# EAGLE design schaltplan_v2 (EAGLE 6.4)
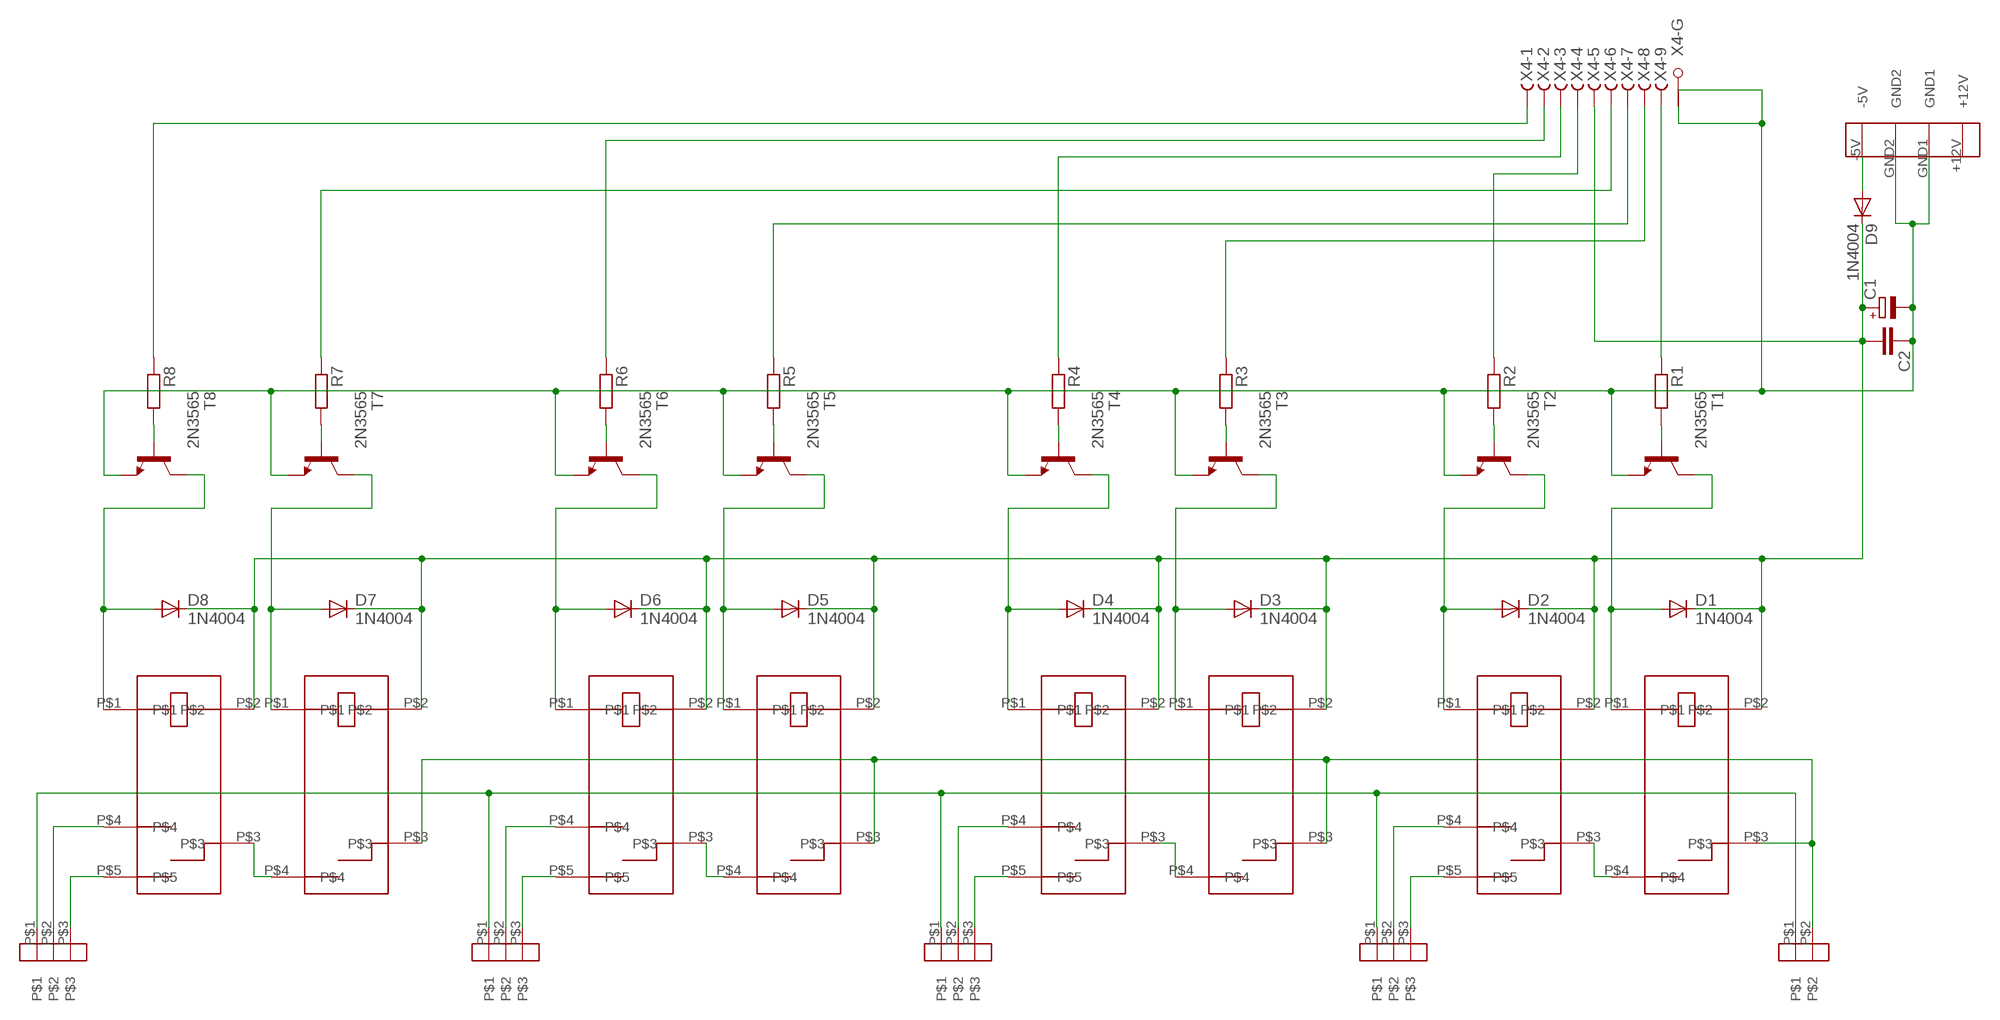
[diagram p0: schematic, sheet 1]

## Parts
C1  CPOL-EUE3.5-8  [E3,5-8]
C2  C-EU025-030X050  [C025-030X050]
D1  1N4004  [DO41-10]
D2  1N4004  [DO41-10]
D3  1N4004  [DO41-10]
D4  1N4004  [DO41-10]
D5  1N4004  [DO41-10]
D6  1N4004  [DO41-10]
D7  1N4004  [DO41-10]
D8  1N4004  [DO41-10]
D9  1N4004  [DO41-10]
R1  R-EU_0207/7  [0207/7]
R2  R-EU_0207/7  [0207/7]
R3  R-EU_0207/7  [0207/7]
R4  R-EU_0207/7  [0207/7]
R5  R-EU_0207/7  [0207/7]
R6  R-EU_0207/7  [0207/7]
R7  R-EU_0207/7  [0207/7]
R8  R-EU_0207/7  [0207/7]
T1  2N3565  [TO92]
T2  2N3565  [TO92]
T3  2N3565  [TO92]
T4  2N3565  [TO92]
T5  2N3565  [TO92]
T6  2N3565  [TO92]
T7  2N3565  [TO92]
T8  2N3565  [TO92]
U$1  JS_05_MN_KT  [JS_05_MN_KT]
U$2  JS_05_N_K  [JS_05_N_K]
U$3  JS_05_MN_KT  [JS_05_MN_KT]
U$4  JS_05_N_K  [JS_05_N_K]
U$5  JS_05_MN_KT  [JS_05_MN_KT]
U$6  JS_05_N_K  [JS_05_N_K]
U$7  JS_05_MN_KT  [JS_05_MN_KT]
U$8  JS_05_N_K  [JS_05_N_K]
U$9  WAGO_734_262  [WAGO_734_262]
U$10  WAGO_734_263  [WAGO_734_263]
U$11  WAGO_734_263  [WAGO_734_263]
U$12  WAGO_734_263  [WAGO_734_263]
U$13  WAGO_734_263  [WAGO_734_263]
U$14  PSW_5  [PSW_5]
X4  F09HPS  [F09HP]

## Nets
GND: C1.- C2.1 T1.3(E) T2.3(E) T3.3(E) T4.3(E) T5.3(E) T6.3(E) T7.3(E) T8.3(E) U$14.GND1 U$14.GND2 X4.G1(-G:G1) X4.G2(-G:G2)
GND2: U$9.P$1 U$10.P$1 U$11.P$1 U$12.P$1 U$13.P$1
N$2: U$2.P$5 U$10.P$3
N$3: U$2.P$4 U$10.P$2
N$4: U$1.P$4 U$2.P$3
N$5: U$1.P$3 U$3.P$3 U$5.P$3 U$7.P$3 U$9.P$2
N$6: D1.A T1.1(C) U$1.P$1
N$7: D9.A U$14.-5V
N$8: R1.2 T1.2(B)
N$10: D2.A T2.1(C) U$2.P$1
N$11: R5.1 X4.7(-7:F)
N$12: D3.A T3.1(C) U$3.P$1
N$13: R6.2 T6.2(B)
N$14: R6.1 X4.2(-2:F)
N$15: R8.1 X4.1(-1:F)
N$16: U$4.P$5 U$11.P$3
N$17: U$4.P$4 U$11.P$2
N$18: U$3.P$4 U$4.P$3
N$19: D4.A T4.1(C) U$4.P$1
N$21: R7.1 X4.6(-6:F)
N$22: R3.2 T3.2(B)
N$23: R4.1 X4.3(-3:F)
N$24: D5.A T5.1(C) U$5.P$1
N$26: R2.1 X4.4(-4:F)
N$27: R2.2 T2.2(B)
N$28: R4.2 T4.2(B)
N$30: U$6.P$5 U$12.P$3
N$31: U$6.P$4 U$12.P$2
N$32: U$5.P$4 U$6.P$3
N$33: D6.A T6.1(C) U$6.P$1
N$34: D7.A T7.1(C) U$7.P$1
N$35: D8.A T8.1(C) U$8.P$1
N$36: R5.2 T5.2(B)
N$37: R3.1 X4.8(-8:F)
N$38: R1.1 X4.9(-9:F)
N$40: R8.2 T8.2(B)
N$42: U$8.P$5 U$13.P$3
N$43: U$8.P$4 U$13.P$2
N$44: U$7.P$4 U$8.P$3
N$48: R7.2 T7.2(B)
V+: C1.+ C2.2 D1.C D2.C D3.C D4.C D5.C D6.C D7.C D8.C D9.C U$1.P$2 U$2.P$2 U$3.P$2 U$4.P$2 U$5.P$2 U$6.P$2 U$7.P$2 U$8.P$2 X4.5(-5:F)
Unconnected: U$14.+12V

## Library data of the parts
C1 = rcl:CPOL-EU: POLARIZED CAPACITOR, European symbol
C2 = rcl:C-EU: CAPACITOR, European symbol
D1-D9 = diode:1N4004: DIODE general purpose rectifier, 1 A
R1-R8 = rcl:R-EU_: RESISTOR, European symbol
T1-T8 = transistor:2N3565: NPN TRANSISTOR
U$1 U$3 U$5 U$7 = n39:JS_05_MN_KT
U$2 U$4 U$6 U$8 = n39:JS_05_N_K: Schaltrelais JK 05 N K http://www.reichelt.de/Print-Steckrelais/JS-05-N-K/3//index.html?ACTION=3&GROUPID=3293&ARTICLE=79414&SHOW=1&START=0&OFFSET=16&
U$9 = n39:WAGO_734_262: WAGO 743-262 Print-Stiftleiste, Mini, RM 3,81, gewinkelt, 2-polig http://www.reichelt.de/WAGO-Stecksysteme/WAGO-734-262/3/index.html?;ACTION=3;LA=446;ARTICLE=45978;GROUPID=5690;artnr=WAGO+734-262;SID=11UOMKs38AAAIAABbvFEc5b11be4da1ac9cc045b827e422a49e7b
U$10-U$13 = n39:WAGO_734_263: WAGO 734-263 Print-Stiftleiste, Mini, RM 3,81, gewinkelt, 3-polig http://www.reichelt.de/WAGO-Stecksysteme/WAGO-734-263/3/index.html?;ACTION=3;LA=446;ARTICLE=45980;GROUPID=5690;artnr=WAGO+734-263;SID=11UOMKs38AAAIAABbvFEc5b11be4da1ac9cc045b827e422a49e7b
U$14 = n39:PSW_5: PSW 5 Stromversorgungsstecker f. 5 1/4 Zoll, Print, gew. http://www.reichelt.de/Floppy-Powerstecker/PSW-5/3/index.html?;ACTION=3;LA=446;ARTICLE=14915;GROUPID=3257;artnr=PSW+5;SID=11UOMKs38AAAIAABbvFEc5b11be4da1ac9cc045b827e422a49e7b
X4 = con-subd:F09HPS: SUB-D; OC_FARNELL: unknown; OC_NEWARK: unknown

## Board
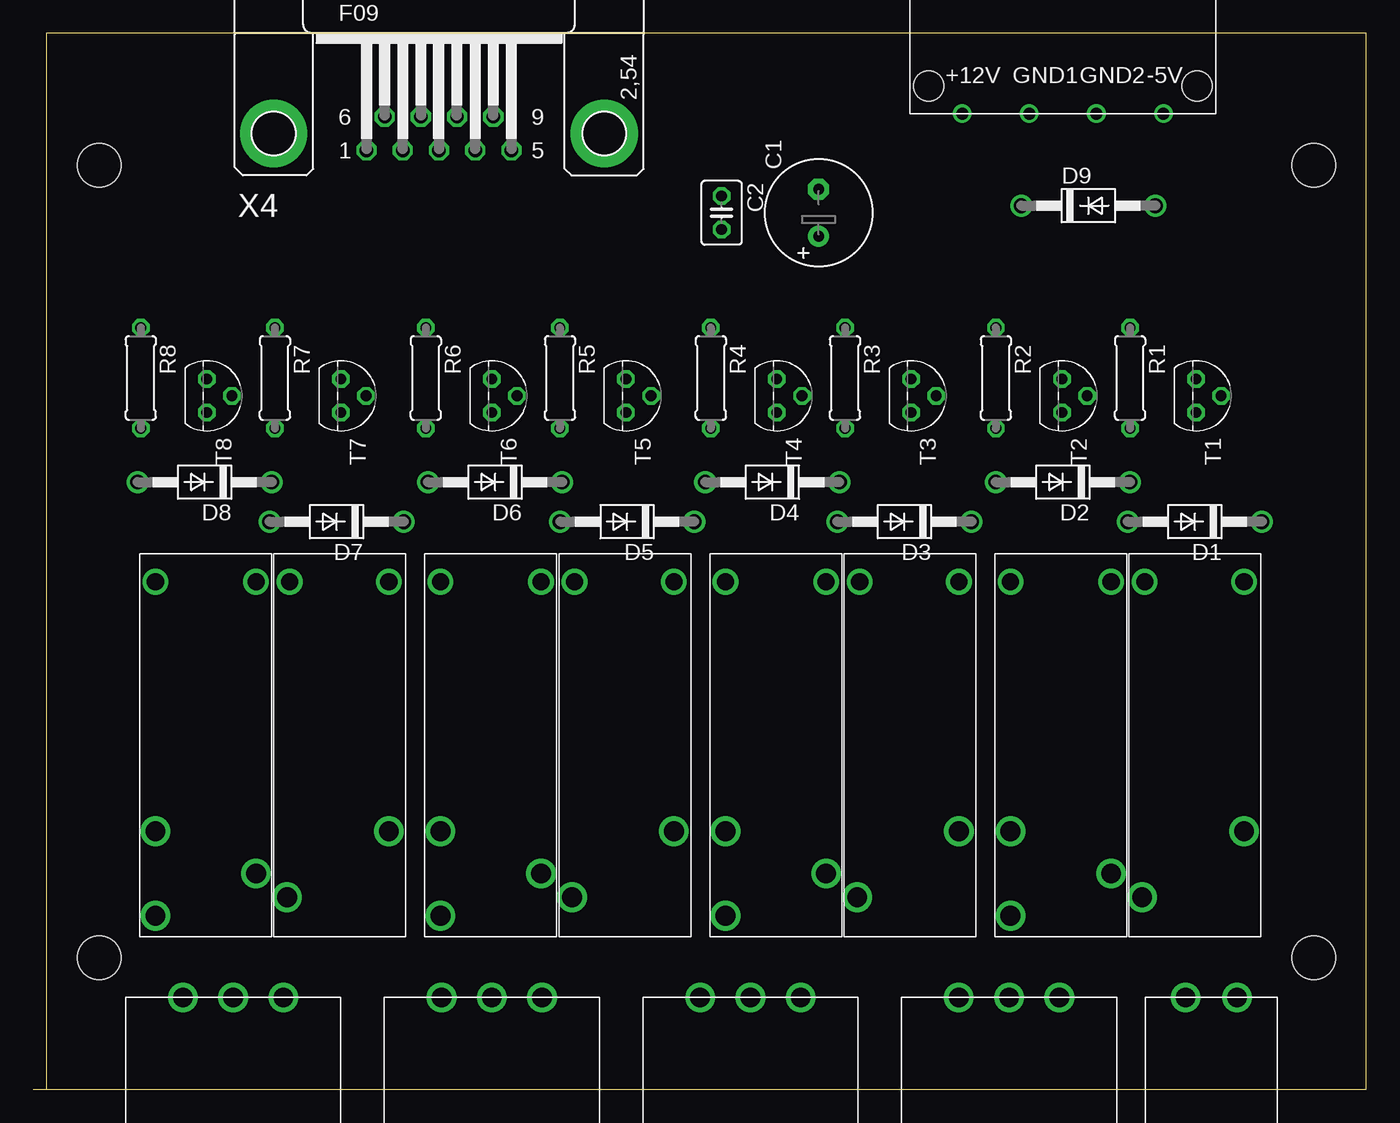
[diagram p1: board, top side]
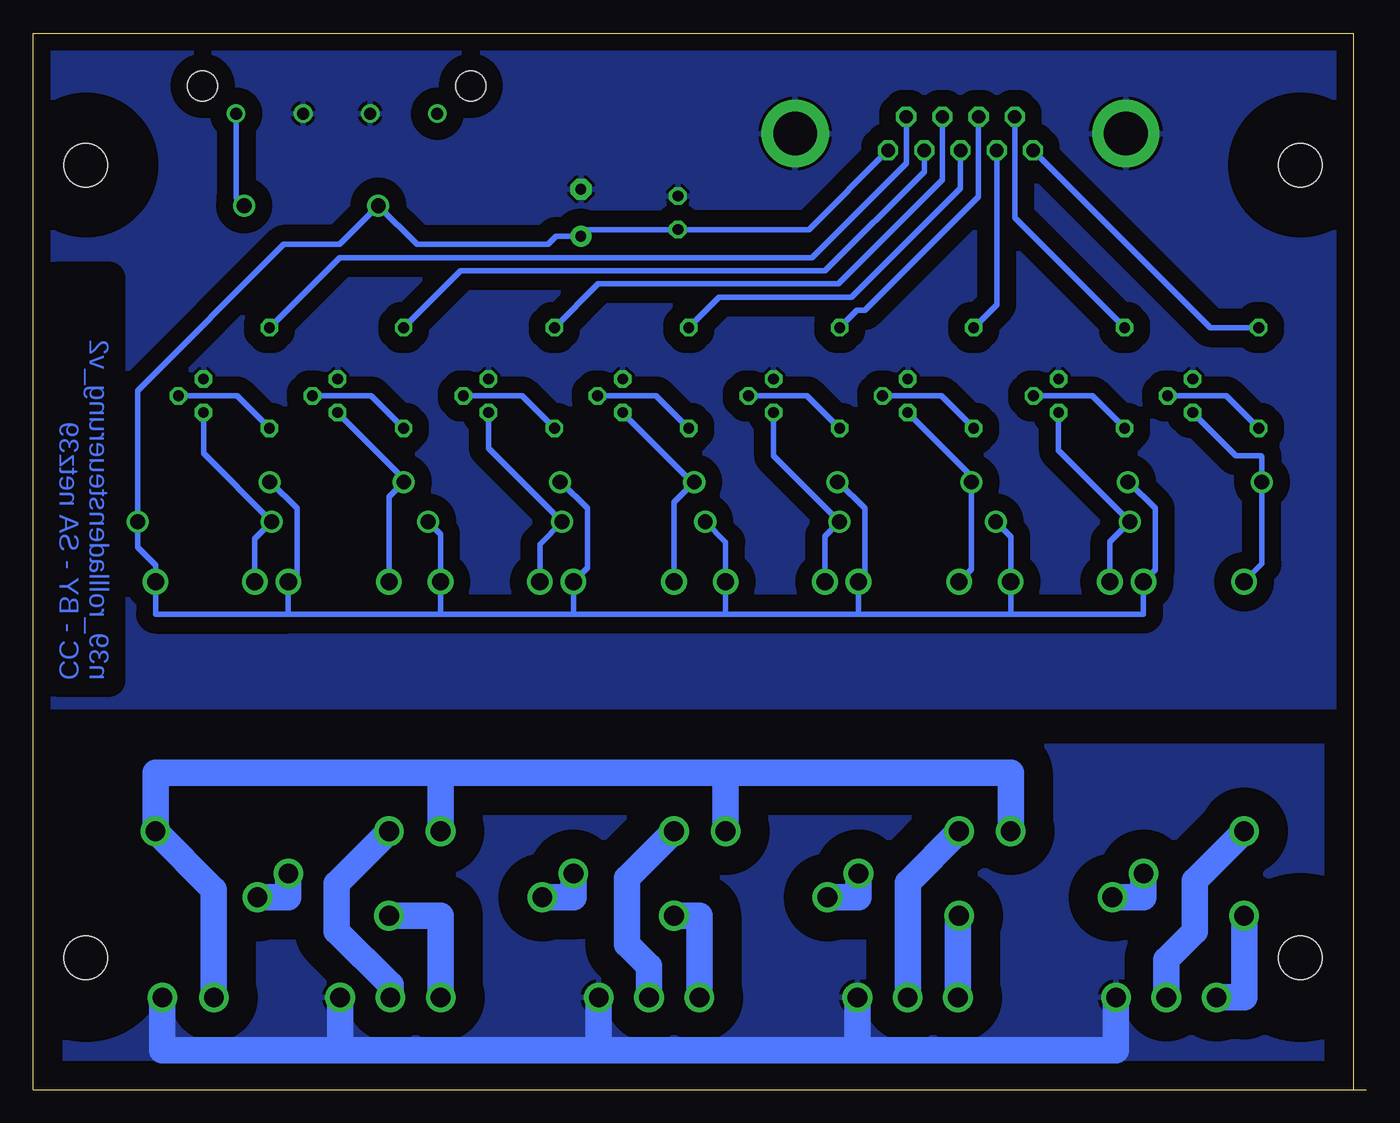
[diagram p2: board, bottom side, seen from below]

Size 101 x 80.01 mm. Coordinates in mm from the lower left corner, seen from the top.
Outline: 101,0.01 101,80.01 1,80.01 1,0.01
Outline: 101,0 0,0
Copper layers (1*16): Top 0.035mm / dielectric 1.5mm / Bottom 0.035mm
Design rules "designrules": minimum track width 12mil, minimum drill 32mil, track to track 12mil, track to pad 12mil, pad to pad 12mil, via to via 12mil, smd to smd 12mil, copper to edge 25mil, drill to drill 12mil, minimum pad ring 10mil, minimum via ring 8mil, stop-mask expansion 4mil, vias tented up to drill 0mil, thermal gap 10mil
Holes 3.3 mm at 5,70.01 97,70.01 97,10.01 5,10.01
bRestrict: area 1,6 to 9,14; area 1,66 to 9,74; area 93,66 to 101,74; area 93,6 to 101,14

### Footprints (pad centres in the part's own frame; a part is rotated, then mirrored left to right if it is on the bottom)
E3,5-8 = drill 0.813 pad 1.6: + -1.778,0 | drill 0.813 pad 1.6 octagon: - 1.778,0
C025-030X050 = drill 0.813 octagon: 1 -1.27,0; 2 1.27,0
DO41-10 = drill 1.118: A 5.08,0; C -5.08,0
0207/7 = drill 0.813 octagon: 1 -3.81,0; 2 3.81,0
TO92 = drill 0.813 octagon: 1 1.27,0; 2 0,1.905; 3 -1.27,0
JS_05_MN_KT = drill 1.3: P$1 2.1,1.19; P$2 2.1,8.71 | drill 1.5: P$3 21,8.71; P$4 26,1
JS_05_N_K = drill 1.3: P$1 2.1,1.19; P$2 2.1,8.81 | drill 1.5: P$3 24.2,8.81; P$4 21,1.19; P$5 27.4,1.19
WAGO_734_262 = drill 1.5: P$1 -1.95,-5.25; P$2 1.95,-5.25
WAGO_734_263 = drill 1.5: P$1 -3.81,-5.25; P$2 0,-5.25; P$3 3.81,-5.25
PSW_5 = drill 0.9: +12V -7.62,-6.1; -5V 7.62,-6.1; GND1 -2.54,-6.1; GND2 2.54,-6.1 | hole 2.3: -10.16,-4; 10.16,-4
F09HP = drill 1.016 octagon: 1 -5.486,-1.27; 2 -2.743,-1.27; 3 0,-1.27; 4 2.743,-1.27; 5 5.486,-1.27; 6 -4.115,1.27; 7 -1.372,1.27; 8 1.372,1.27; 9 4.115,1.27 | drill 3.302 pad 5.08: G1 -12.522,0; G2 12.522,0

### Placement (x,y rotation side)
C1  59.5,66.4 90 top
C2  52.15,66.4 270 top
D1  88,43.01 180 top
D2  78,46.01 180 top
D3  66,43.01 180 top
D4  56,46.01 180 top
D5  45,43.01 180 top
D6  35,46.01 180 top
D7  23,43.01 180 top
D8  13,46.01 180 top
D9  79.93,66.94 0 top
R1  83.09,53.89 270 top
R2  72.93,53.89 270 top
R3  61.5,53.89 270 top
R4  51.34,53.89 270 top
R5  39.91,53.89 270 top
R6  29.75,53.89 270 top
R7  18.32,53.89 270 top
R8  8.16,53.89 270 top
T1  88.09,52.54 270 top
T2  77.93,52.54 270 top
T3  66.5,52.54 270 top
T4  56.34,52.54 270 top
T5  44.91,52.54 270 top
T6  34.75,52.54 270 top
T7  23.32,52.54 270 top
T8  13.16,52.54 270 top
U$1  83.01,40.57 270 top
U$2  72.85,40.57 270 top
U$3  61.42,40.57 270 top
U$4  51.26,40.57 270 top
U$5  39.83,40.57 270 top
U$6  29.67,40.57 270 top
U$7  18.24,40.57 270 top
U$8  8.08,40.57 270 top
U$9  89.25,1.74 180 top
U$10  73.93,1.74 180 top
U$11  54.34,1.74 180 top
U$12  34.75,1.74 180 top
U$13  15.16,1.74 180 top
U$14  78,80.01 0 top
X4  30.75,72.4 0 top

### Tracks (layer width: path | path; a pad name or v marks a point on that pad's centre or on a via)
GND
  pour Bottom (isolate 1.27): 2,79.01 100,79.01 100,29.01 2,29.01
GND2
  Bottom 2: U$9.P$1 91.2,3.01 77.74,3.01 | U$10.P$1 77.74,3.01 | 77.74,3.01 58.15,3.01 | U$11.P$1 58.15,3.01 | 58.15,3.01 38.56,3.01 | U$12.P$1 38.56,3.01 | 38.56,3.01 18.97,3.01 U$13.P$1
  pour Bottom (isolate 2.184): 2,1.01 2,26.01 100,26.01 100,1.01
N$2
  Bottom 2: U$2.P$5 70.12,13.17 U$10.P$3
N$3
  Bottom 2: U$2.P$4 78,15.61 78,12.01 73.93,7.94 U$10.P$2
N$4
  Bottom 2: U$1.P$4 81.66,14.57 U$2.P$3
N$5
  Bottom 2: U$9.P$2 87.3,15.15 U$1.P$3 91.72,24.01 70.13,24.01 | U$3.P$3 70.13,24.01 | 70.13,24.01 48.54,24.01 | U$5.P$3 48.54,24.01 | 48.54,24.01 26.95,24.01 U$7.P$3
N$6
  Bottom 0.406: U$1.P$1 84.2,41.73 D1.A 88.09,48.18 T1.1
N$7
  Bottom 0.406: U$14.-5V 85.62,67.55 D9.A
N$8
  Bottom 0.406: T1.2 85.55,52.54 R1.2
N$10
  Bottom 0.406: U$2.P$1 74.04,44.89 D2.A 72.92,46.26 T2.1
N$11
  Bottom 0.406: X4.7 29.38,67.63 38,59.01 38.6,59.01 R5.1
N$12
  Bottom 0.406: T3.1 66.5,48.59 D3.A 62.61,41.32 U$3.P$1
N$13
  Bottom 0.406: T6.2 32.21,52.54 R6.2
N$14
  Bottom 0.406: R6.1 28.01,59.44 X4.2
N$15
  Bottom 0.406: X4.1 11.83,57.7 R8.1
N$16
  Bottom 2: U$4.P$5 50.53,13.17 U$11.P$3
N$17
  Bottom 2: U$4.P$4 56,16.02 56,11.01 54.34,9.35 U$11.P$2
N$18
  Bottom 2: U$3.P$4 60.07,14.57 U$4.P$3
N$19
  Bottom 0.406: U$4.P$1 52.45,44.48 D4.A 51.08,46.01 T4.1
N$21
  Bottom 0.406: R7.1 26.64,66.02 X4.6
N$22
  Bottom 0.406: T3.2 63.96,52.54 R3.2
N$23
  Bottom 0.406: X4.3 30.75,68.26 39,60.01 49.03,60.01 R4.1
N$24
  Bottom 0.406: T5.1 44.91,48 D5.A 41.02,41.91 U$5.P$1
N$26
  Bottom 0.406: X4.4 33.49,69.52 41,62.01 68.62,62.01 R2.1
N$27
  Bottom 0.406: T2.2 75.39,52.54 R2.2
N$28
  Bottom 0.406: T4.2 53.8,52.54 R4.2
N$30
  Bottom 2: U$6.P$5 30.94,13.09 U$12.P$3
N$31
  Bottom 2: U$6.P$4 34.75,15.68 U$12.P$2
N$32
  Bottom 2: U$5.P$4 38.48,14.57 U$6.P$3
N$33
  Bottom 0.406: U$6.P$1 29.92,39.41 D6.A 29.92,46.44 T6.1
N$34
  Bottom 0.406: T7.1 23.32,48.41 D7.A 19.43,41.5 U$7.P$1
N$35
  Bottom 0.406: U$8.P$1 7.92,39.82 D8.A 7.92,47.93 8,48.01 9.9,48.01 T8.1
N$36
  Bottom 0.406: T5.2 42.37,52.54 R5.2
N$37
  Bottom 0.406: X4.8 32.12,68.89 40,61.01 58.19,61.01 R3.1
N$38
  Bottom 0.406: X4.9 34.87,70.15 42,63.01 77.78,63.01 R1.1
N$40
  Bottom 0.406: T8.2 10.62,52.54 R8.2
N$42
  Bottom 2: U$8.P$5 9.27,6.99 U$13.P$3
N$43
  Bottom 2: U$8.P$4 13,15.84 13,12.01 15.16,9.85 U$13.P$2
N$44
  Bottom 2: U$7.P$4 16.89,14.57 U$8.P$3
N$48
  Bottom 0.406: T7.2 20.78,52.54 R7.2
V+
  Bottom 0.406: 81.66,36.01 U$2.P$2 81,39.13 81,44.01 83,46.01 D2.C | 70.13,36.01 U$3.P$2 70.13,42.06 D3.C | 70.13,36.01 81.66,36.01 | 60.07,36.01 U$4.P$2 59,39.54 59,44.01 61,46.01 D4.C | 60.07,36.01 70.13,36.01 | 48.54,36.01 U$5.P$2 48.54,41.47 D5.C | 48.54,36.01 60.07,36.01 | 38.48,36.01 U$6.P$2 38,38.95 38,44.01 40,46.01 D6.C | 38.48,36.01 48.54,36.01 | 26.95,36.01 U$7.P$2 26.95,41.88 D7.C | 26.95,36.01 38.48,36.01 | 26.95,36.01 16.89,36.01 U$8.P$2 16,39.36 16,44.01 18,46.01 D8.C | 81.66,36.01 91.72,36.01 U$1.P$2 91.72,39.73 93.08,41.09 D1.C 93.08,52.93 82,64.01 77.78,64.01 D9.C 71.92,64.01 62,64.01 61.39,64.62 C1.+ 58.99,65.13 C2.2 42.24,65.13 X4.5

### Text on the board
Bottom: n39_rollladensteuerung_v2 / CC - BY - SA netz39